# EAGLE schematic toysla_schematic (EAGLE 9.5.2)
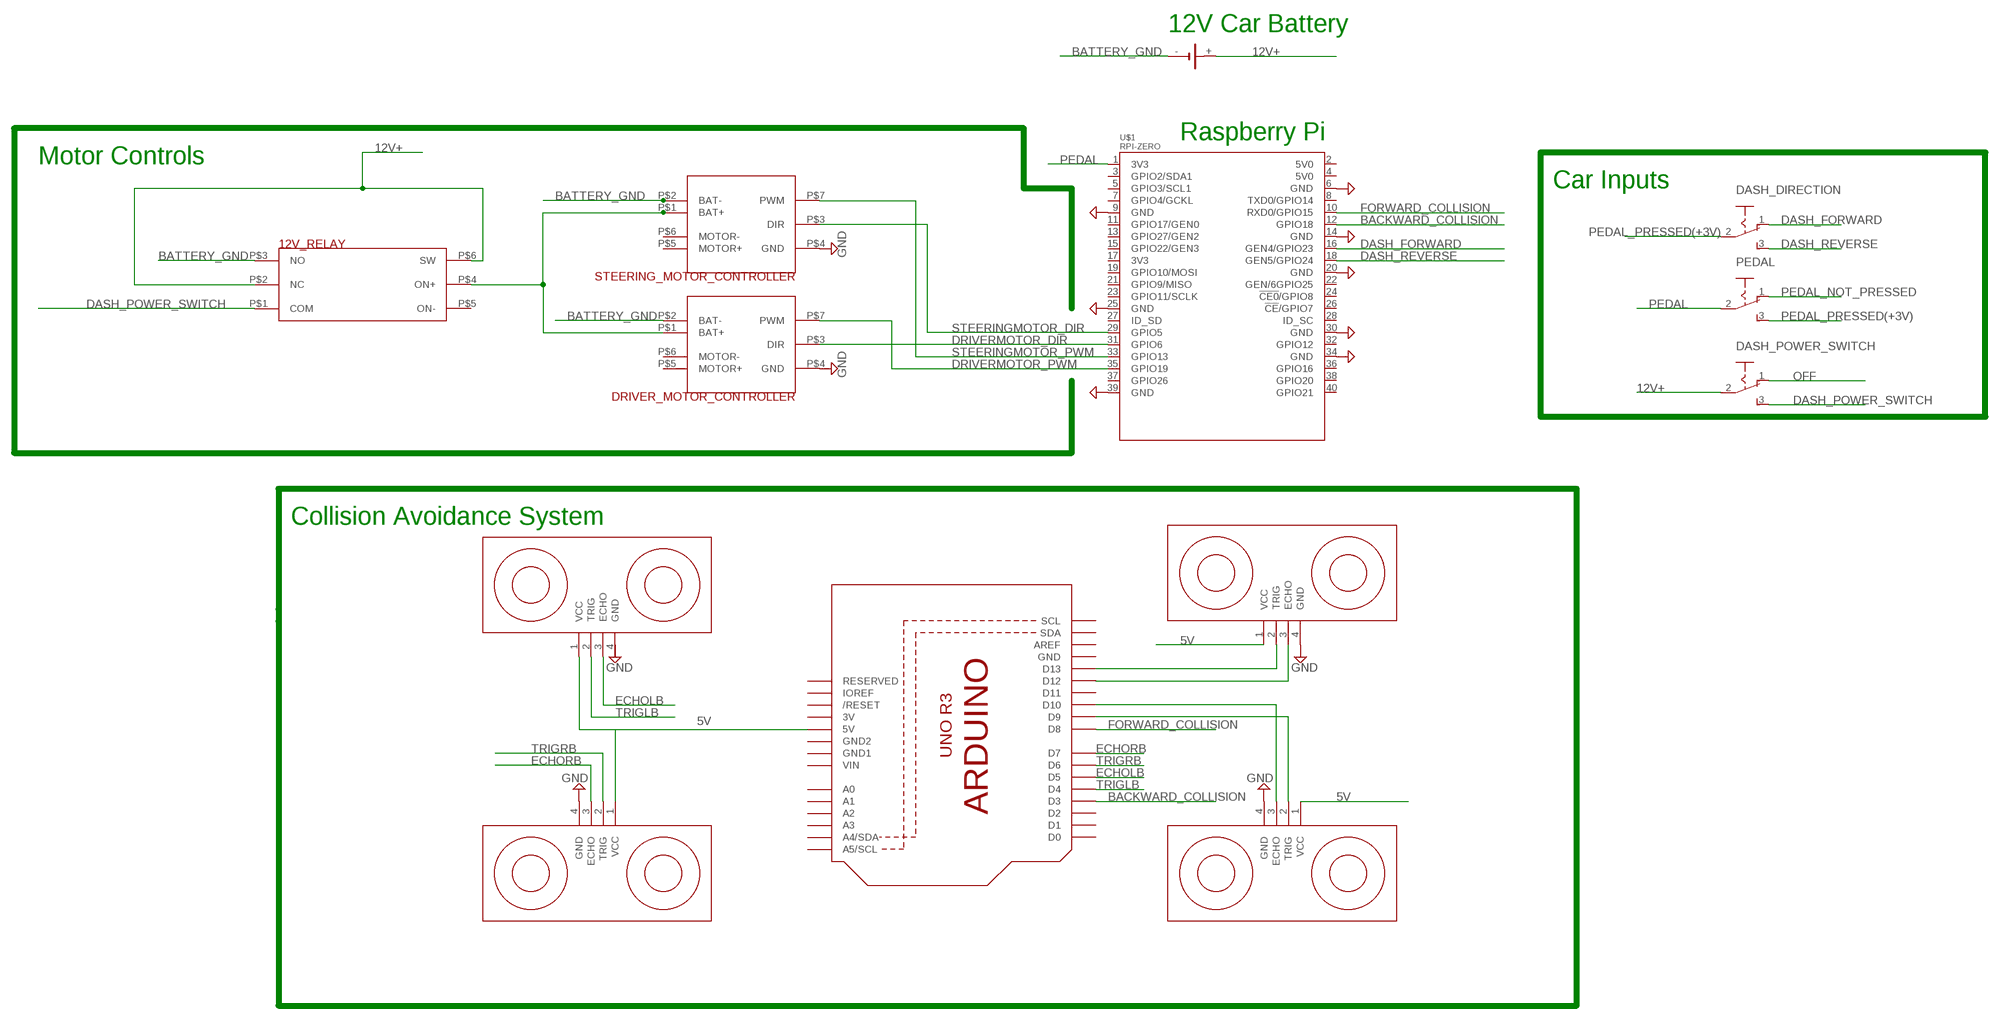
[diagram p0: schematic, sheet 1]

## Parts
12V_RELAY  RELAY  [RELAY]
DASH_DIRECTION  255SB  [255SB]
DASH_POWER_SWITCH  255SB  [255SB]
DRIVER_MOTOR_CONTROLLER  MOTORCONTROLLER  [MOTORCONTROLLER]
G1  CH23-1220LF  [CH23-1220LF]
PEDAL  255SB  [255SB]
STEERING_MOTOR_CONTROLLER  MOTORCONTROLLER  [MOTORCONTROLLER]
U1  ARDUINOR3-DIMENSION  [ARDUINOR3]
U$1  RPI-ZERO  [RASPBERRYPI_BASTELSTUBE_V13_RASPI_BOARD_B+_FULL]
U$2  ULTRASONIC-HC-SR04  [ULTRASONIC-HC-SR04]
U$4  ULTRASONIC-HC-SR04  [ULTRASONIC-HC-SR04]
U$6  ULTRASONIC-HC-SR04  [ULTRASONIC-HC-SR04]
U$7  ULTRASONIC-HC-SR04  [ULTRASONIC-HC-SR04]

## Nets
5V: U1.5V U$2.1(VCC) U$4.1(VCC) U$6.1(VCC) U$7.1(VCC)
12V+: 12V_RELAY.P$2(NC) 12V_RELAY.P$6(SW) DASH_POWER_SWITCH.2(P) G1.+
BACKWARD_COLLISION: U1.D3 U$1.12(GPIO18)
BATTERY_GND: 12V_RELAY.P$3(NO) DRIVER_MOTOR_CONTROLLER.P$2(BAT-) G1.- STEERING_MOTOR_CONTROLLER.P$2(BAT-)
DASH_FORWARD: DASH_DIRECTION.1(O) U$1.16(GEN4/GPIO23)
DASH_POWER_SWITCH: 12V_RELAY.P$1(COM) DASH_POWER_SWITCH.3(S)
DASH_REVERSE: DASH_DIRECTION.3(S) U$1.18(GEN5/GPIO24)
DRIVERMOTOR_DIR: DRIVER_MOTOR_CONTROLLER.P$3(DIR) U$1.31(GPIO6)
DRIVERMOTOR_PWM: DRIVER_MOTOR_CONTROLLER.P$7(PWM) U$1.35(GPIO19)
ECHOLB: U1.D5 U$2.3(ECHO)
ECHORB: U1.D7 U$6.3(ECHO)
FORWARD_COLLISION: U1.D8 U$1.10(RXD0/GPIO15)
GND: DRIVER_MOTOR_CONTROLLER.P$4(GND) STEERING_MOTOR_CONTROLLER.P$4(GND) U$1.9(GND) U$1.14(GND) U$1.20(GND) U$1.34(GND) U$1.39(GND) U$4.4(GND) U$6.4(GND) U$7.4(GND)
GND@2: U$1.25(GND) ; supply symbol labelled GND
GND@6: U$1.30(GND) ; supply symbol labelled GND
GND@8: U$1.6(GND) ; supply symbol labelled GND
N$1: 12V_RELAY.P$4(ON+) DRIVER_MOTOR_CONTROLLER.P$1(BAT+) STEERING_MOTOR_CONTROLLER.P$1(BAT+)
N$3: U1.D12 U$4.3(ECHO)
N$4: U1.D13 U$4.2(TRIG)
N$5: U1.D9 U$7.2(TRIG)
N$6: U1.D10 U$7.3(ECHO)
OFF: DASH_POWER_SWITCH.1(O)
PEDAL: PEDAL.2(P) U$1.1(3V3)
PEDAL_NOT_PRESSED: PEDAL.1(O)
PEDAL_PRESSED(+3V): DASH_DIRECTION.2(P) PEDAL.3(S)
STEERINGMOTOR_DIR: STEERING_MOTOR_CONTROLLER.P$3(DIR) U$1.29(GPIO5)
STEERINGMOTOR_PWM: STEERING_MOTOR_CONTROLLER.P$7(PWM) U$1.33(GPIO13)
TRIGLB: U1.D4 U$2.2(TRIG)
TRIGRB: U1.D6 U$6.2(TRIG)
Unconnected: 12V_RELAY.P$5(ON-) DRIVER_MOTOR_CONTROLLER.P$5(MOTOR+) DRIVER_MOTOR_CONTROLLER.P$6(MOTOR-) STEERING_MOTOR_CONTROLLER.P$5(MOTOR+) STEERING_MOTOR_CONTROLLER.P$6(MOTOR-) U1.A0 U1.A1 U1.A2 U1.A3 U1.A4(A4/SDA) U1.A5(A5/SCL) U1.AREF U1.D0 U1.D1 U1.D2 U1.D11 U1.IOREF U1.RESERVED U1.RESET(/RESET) U1.SCL U1.SDA U$1.2(5V0) U$1.3(GPIO2/SDA1) U$1.4(5V0) U$1.5(GPIO3/SCL1) U$1.7(GPIO4/GCKL) U$1.8(TXD0/GPIO14) U$1.11(GPIO17/GEN0) U$1.13(GPIO27/GEN2) U$1.15(GPIO22/GEN3) U$1.17(3V3) U$1.19(GPIO10/MOSI) U$1.21(GPIO9/MISO) U$1.22(GEN/6GPIO25) U$1.23(GPIO11/SCLK) U$1.24(!CE0!/GPIO8) U$1.26(!CE!/GPIO7) U$1.27(ID_SD) U$1.28(ID_SC) U$1.32(GPIO12) U$1.36(GPIO16) U$1.37(GPIO26) U$1.38(GPIO20) U$1.40(GPIO21)

## Notes on the sheet
- 12V Car Battery
- Raspberry Pi
- Motor Controls
- Car Inputs
- Collision Avoidance System

## Power pins joined to a net without a drawn wire
3V: U1.3V
GND: U1.GND U$2.4(GND)
GND1: U1.GND1
GND2: U1.GND2
VIN: U1.VIN

## Library data of the parts
12V_RELAY = Toysla:RELAY
DASH_DIRECTION DASH_POWER_SWITCH PEDAL = switch:255SB: SLIDING SWITCH Distributor Buerklin, 11G810
DRIVER_MOTOR_CONTROLLER STEERING_MOTOR_CONTROLLER = Toysla:MOTORCONTROLLER
G1 = battery:CH23-1220LF: Battary Holder, DIP, 12mm multicomp PART NO. CH-1220LF Source: Data sheet <http://www.farnell.com/datasheets/1505861.pdf>
U1 = adafruit:ARDUINOR3: This is a new object for the new Arduino R3 - with extra pins that you may want to use (such as IOref, and duplicated A4/A5
U$1 = RPI-Zero:RPI-ZERO
U$2 U$4 U$6 U$7 = diy-modules:ULTRASONIC-HC-SR04: Ultrasonic Ranging Module HC-SR04